# EAGLE design calculator (EAGLE 7.7.0)
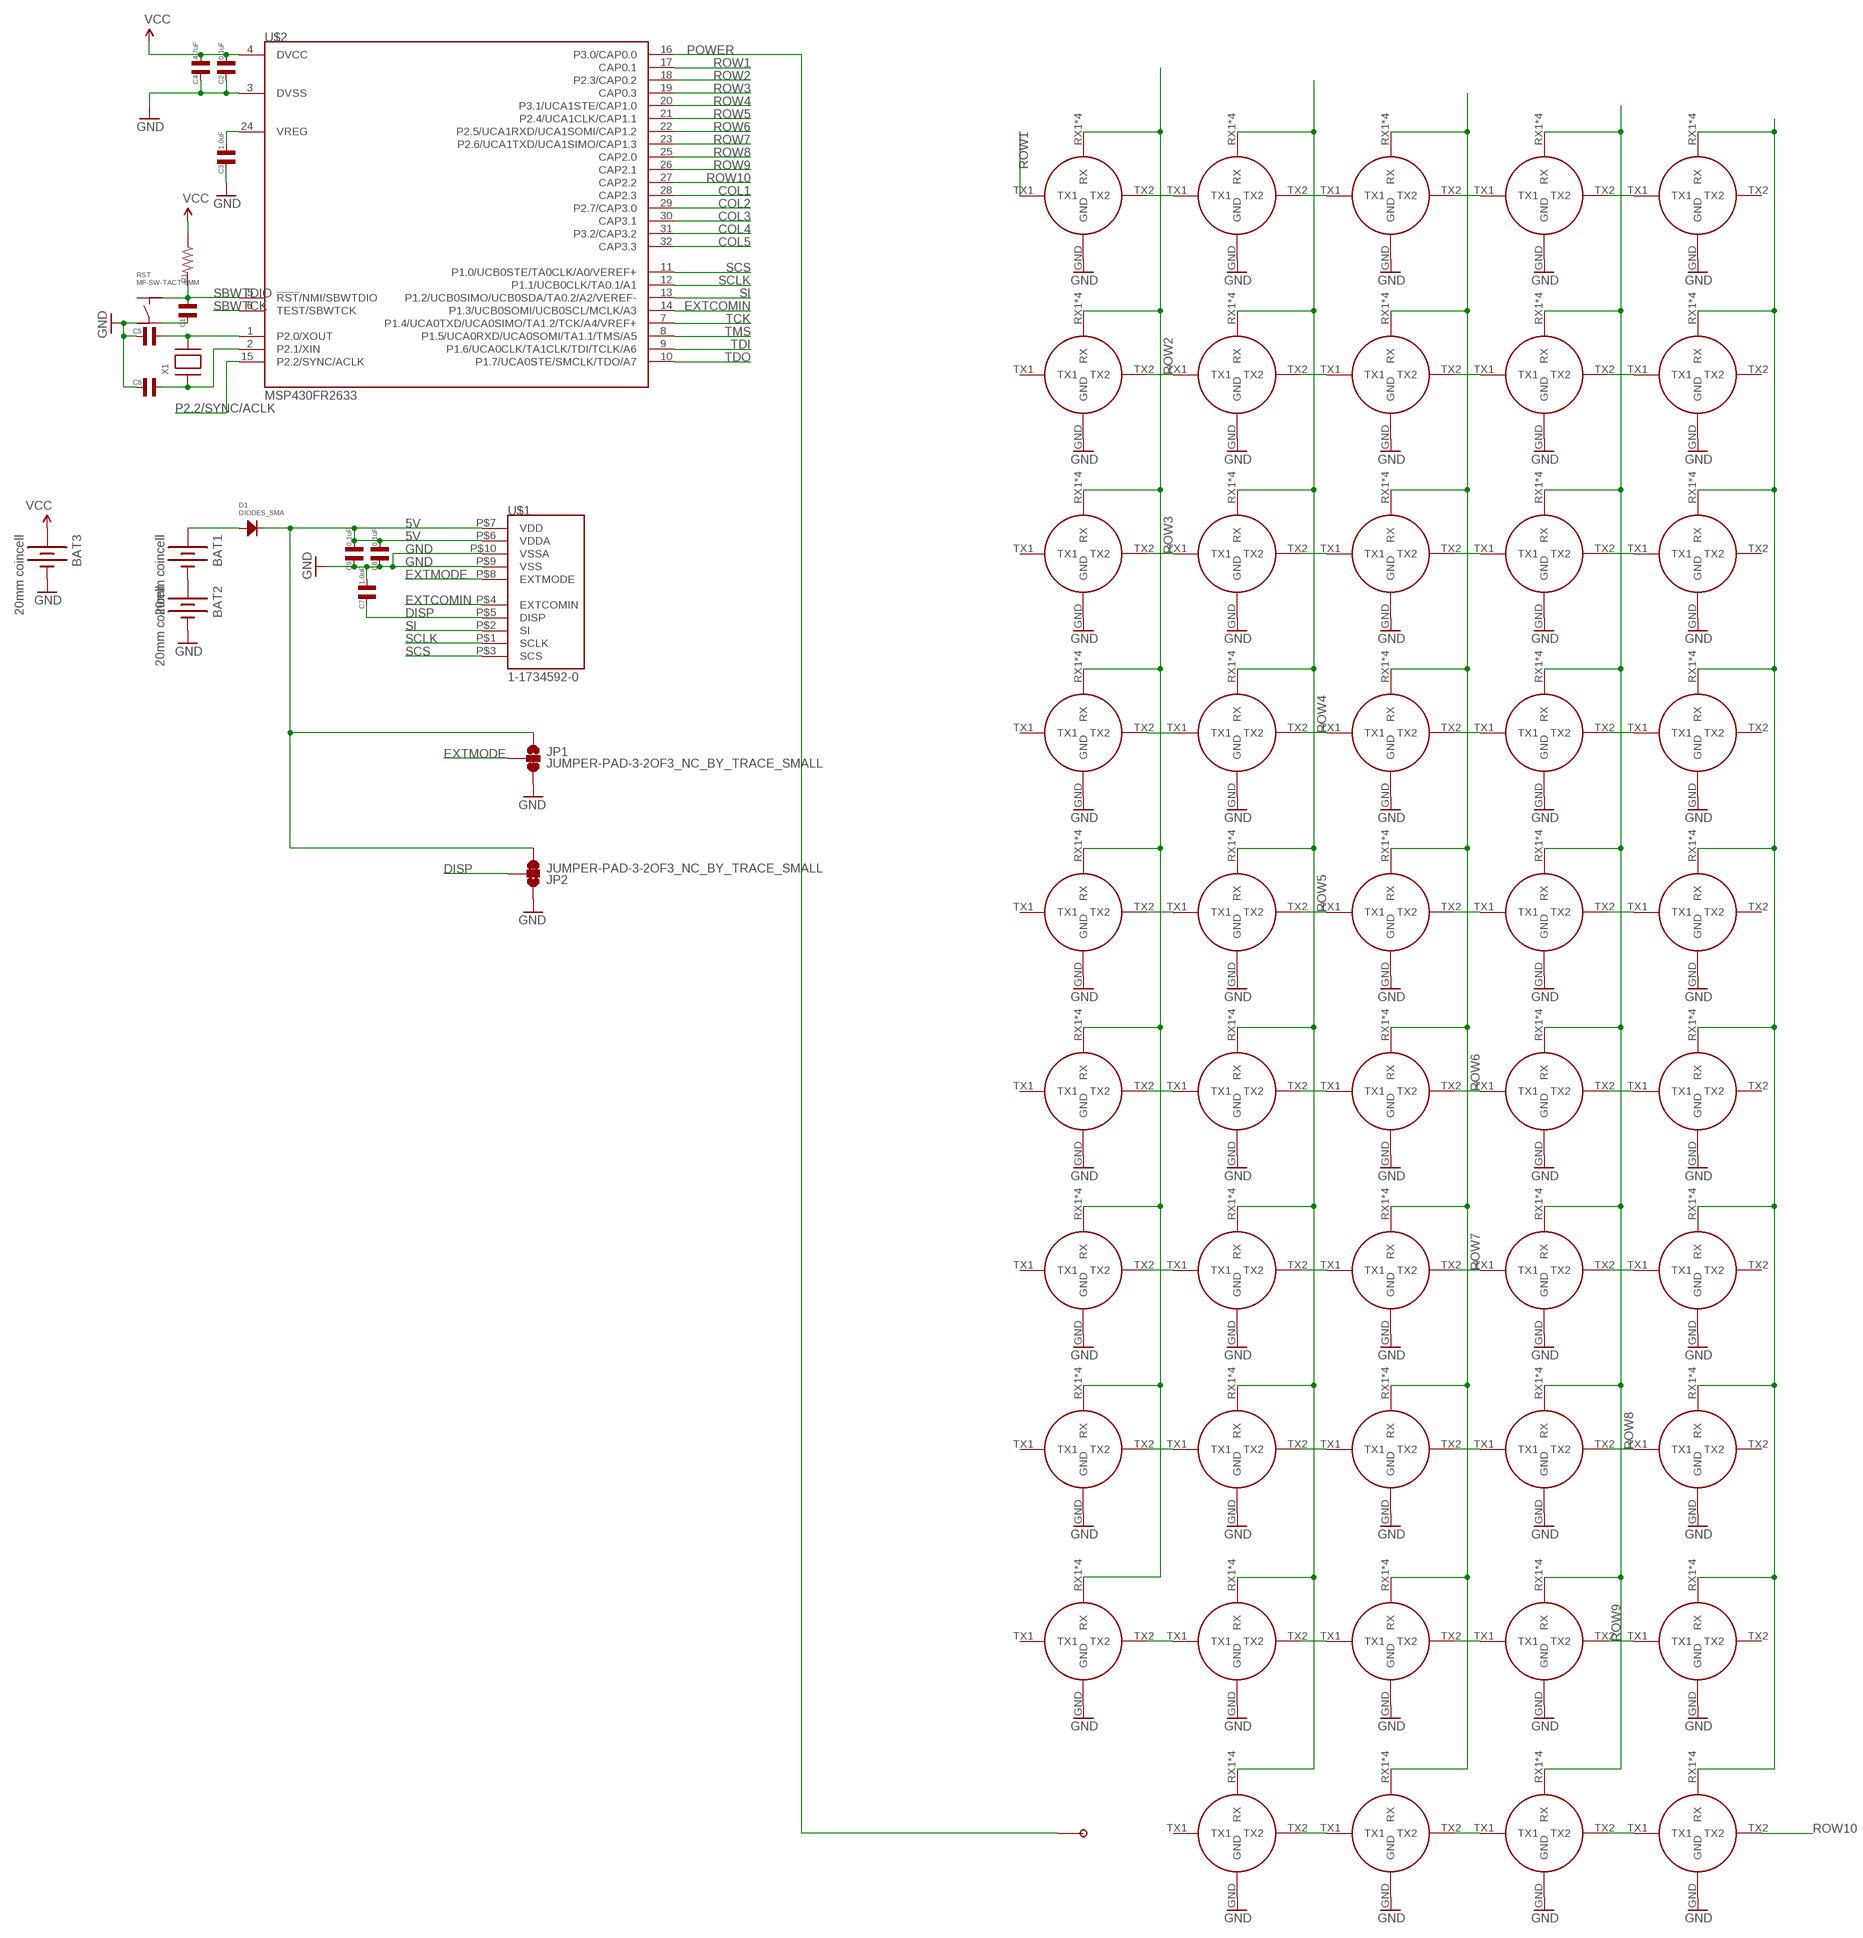
[diagram p0: schematic, sheet 1]

## Parts
BAT1  20mm coincell  BATTERY20MM_4LEGS  [BATTCON_20MM_4LEGS]
BAT2  20mm coincell  BATTERY20MM_4LEGS  [BATTCON_20MM_4LEGS]
BAT3  20mm coincell  BATTERY20MM_4LEGS  [BATTCON_20MM_4LEGS]
C1  CAPACITOR_NP_0603  [C0603]
C2  0.1uF  CAPACITOR_NP_0603  [C0603]
C3  1.0uF  CAPACITOR_NP_0603  [C0603]
C4  4.7uF  CAPACITOR_NP_0603  [C0603]
C5  CAPACITOR_NP_0402  [C0402]
C6  CAPACITOR_NP_0402  [C0402]
C7  1.0uF  CAPACITOR_NP_0603  [C0603]
C8  0.1uF  CAPACITOR_NP_0603  [C0603]
C9  0.1uF  CAPACITOR_NP_0603  [C0603]
D1  DIODES_SMA  [SMA]
JP1  JUMPER-PAD-3-2OF3_NC_BY_TRACE_SMALL  [PAD-JUMPER-3-2OF3_NC_BY_TRACE_YES_SILK_FULL_BOX]
JP2  JUMPER-PAD-3-2OF3_NC_BY_TRACE_SMALL  [PAD-JUMPER-3-2OF3_NC_BY_TRACE_YES_SILK_FULL_BOX]
P1  CAPPADPAD  [CAPTOUCHBTN2]
R1  RESISTOR_0603  [R0603]
RST  MF-SW-TACT-6MM  TACT_6MM  [TACT6MM]
U$1  1-1734592-0  [1-1734592-0]
U$2  MSP430FR2633  [TSSOP32]
U$3  CAPTOUCH  [CAPTOUCHBTN]
U$4  CAPTOUCH  [CAPTOUCHBTN]
U$5  CAPTOUCH  [CAPTOUCHBTN]
U$6  CAPTOUCH  [CAPTOUCHBTN]
U$7  CAPTOUCH  [CAPTOUCHBTN]
U$8  CAPTOUCH  [CAPTOUCHBTN]
U$9  CAPTOUCH  [CAPTOUCHBTN]
U$10  CAPTOUCH  [CAPTOUCHBTN]
U$11  CAPTOUCH  [CAPTOUCHBTN]
U$12  CAPTOUCH  [CAPTOUCHBTN]
U$13  CAPTOUCH  [CAPTOUCHBTN]
U$14  CAPTOUCH  [CAPTOUCHBTN]
U$15  CAPTOUCH  [CAPTOUCHBTN]
U$16  CAPTOUCH  [CAPTOUCHBTN]
U$17  CAPTOUCH  [CAPTOUCHBTN]
U$18  CAPTOUCH  [CAPTOUCHBTN]
U$19  CAPTOUCH  [CAPTOUCHBTN]
U$20  CAPTOUCH  [CAPTOUCHBTN]
U$21  CAPTOUCH  [CAPTOUCHBTN]
U$22  CAPTOUCH  [CAPTOUCHBTN]
U$23  CAPTOUCH  [CAPTOUCHBTN]
U$24  CAPTOUCH  [CAPTOUCHBTN]
U$25  CAPTOUCH  [CAPTOUCHBTN]
U$26  CAPTOUCH  [CAPTOUCHBTN]
U$27  CAPTOUCH  [CAPTOUCHBTN]
U$28  CAPTOUCH  [CAPTOUCHBTN]
U$29  CAPTOUCH  [CAPTOUCHBTN]
U$30  CAPTOUCH  [CAPTOUCHBTN]
U$31  CAPTOUCH  [CAPTOUCHBTN]
U$32  CAPTOUCH  [CAPTOUCHBTN]
U$33  CAPTOUCH  [CAPTOUCHBTN]
U$34  CAPTOUCH  [CAPTOUCHBTN]
U$35  CAPTOUCH  [CAPTOUCHBTN]
U$36  CAPTOUCH  [CAPTOUCHBTN]
U$37  CAPTOUCH  [CAPTOUCHBTN]
U$38  CAPTOUCH  [CAPTOUCHBTN]
U$39  CAPTOUCH  [CAPTOUCHBTN]
U$40  CAPTOUCH  [CAPTOUCHBTN]
U$41  CAPTOUCH  [CAPTOUCHBTN]
U$42  CAPTOUCH  [CAPTOUCHBTN]
U$43  CAPTOUCH  [CAPTOUCHBTN]
U$44  CAPTOUCH  [CAPTOUCHBTN]
U$45  CAPTOUCH  [CAPTOUCHBTN]
U$46  CAPTOUCH  [CAPTOUCHBTN]
U$47  CAPTOUCH  [CAPTOUCHBTN]
U$48  CAPTOUCH  [CAPTOUCHBTN]
U$49  CAPTOUCH  [CAPTOUCHBTN]
U$50  CAPTOUCH  [CAPTOUCHBTN]
U$51  CAPTOUCH  [CAPTOUCHBTN]
X1  XTAL-3.2X1.5  [XTAL3215]

## Nets
5V: C8.P$1 C9.P$1 D1.CATHODE JP1.1 JP2.3 U$1.P$6(VDDA) U$1.P$7(VDD)
COL1: U$2.28(CAP2.3) U$3.RX1(RX) U$3.RX2(RX) U$3.RX3(RX) U$3.RX4(RX) U$8.RX1(RX) U$8.RX2(RX) U$8.RX3(RX) U$8.RX4(RX) U$13.RX1(RX) U$13.RX2(RX) U$13.RX3(RX) U$13.RX4(RX) U$18.RX1(RX) U$18.RX2(RX) U$18.RX3(RX) U$18.RX4(RX) U$23.RX1(RX) U$23.RX2(RX) U$23.RX3(RX) U$23.RX4(RX) U$28.RX1(RX) U$28.RX2(RX) U$28.RX3(RX) U$28.RX4(RX) U$33.RX1(RX) U$33.RX2(RX) U$33.RX3(RX) U$33.RX4(RX) U$38.RX1(RX) U$38.RX2(RX) U$38.RX3(RX) U$38.RX4(RX) U$43.RX1(RX) U$43.RX2(RX) U$43.RX3(RX) U$43.RX4(RX)
COL2: U$2.29(P2.7/CAP3.0) U$4.RX1(RX) U$4.RX2(RX) U$4.RX3(RX) U$4.RX4(RX) U$9.RX1(RX) U$9.RX2(RX) U$9.RX3(RX) U$9.RX4(RX) U$14.RX1(RX) U$14.RX2(RX) U$14.RX3(RX) U$14.RX4(RX) U$19.RX1(RX) U$19.RX2(RX) U$19.RX3(RX) U$19.RX4(RX) U$24.RX1(RX) U$24.RX2(RX) U$24.RX3(RX) U$24.RX4(RX) U$29.RX1(RX) U$29.RX2(RX) U$29.RX3(RX) U$29.RX4(RX) U$34.RX1(RX) U$34.RX2(RX) U$34.RX3(RX) U$34.RX4(RX) U$39.RX1(RX) U$39.RX2(RX) U$39.RX3(RX) U$39.RX4(RX) U$44.RX1(RX) U$44.RX2(RX) U$44.RX3(RX) U$44.RX4(RX) U$48.RX1(RX) U$48.RX2(RX) U$48.RX3(RX) U$48.RX4(RX)
COL3: U$2.30(CAP3.1) U$5.RX1(RX) U$5.RX2(RX) U$5.RX3(RX) U$5.RX4(RX) U$10.RX1(RX) U$10.RX2(RX) U$10.RX3(RX) U$10.RX4(RX) U$15.RX1(RX) U$15.RX2(RX) U$15.RX3(RX) U$15.RX4(RX) U$20.RX1(RX) U$20.RX2(RX) U$20.RX3(RX) U$20.RX4(RX) U$25.RX1(RX) U$25.RX2(RX) U$25.RX3(RX) U$25.RX4(RX) U$30.RX1(RX) U$30.RX2(RX) U$30.RX3(RX) U$30.RX4(RX) U$35.RX1(RX) U$35.RX2(RX) U$35.RX3(RX) U$35.RX4(RX) U$40.RX1(RX) U$40.RX2(RX) U$40.RX3(RX) U$40.RX4(RX) U$45.RX1(RX) U$45.RX2(RX) U$45.RX3(RX) U$45.RX4(RX) U$49.RX1(RX) U$49.RX2(RX) U$49.RX3(RX) U$49.RX4(RX)
COL4: U$2.31(P3.2/CAP3.2) U$6.RX1(RX) U$6.RX2(RX) U$6.RX3(RX) U$6.RX4(RX) U$11.RX1(RX) U$11.RX2(RX) U$11.RX3(RX) U$11.RX4(RX) U$16.RX1(RX) U$16.RX2(RX) U$16.RX3(RX) U$16.RX4(RX) U$21.RX1(RX) U$21.RX2(RX) U$21.RX3(RX) U$21.RX4(RX) U$26.RX1(RX) U$26.RX2(RX) U$26.RX3(RX) U$26.RX4(RX) U$31.RX1(RX) U$31.RX2(RX) U$31.RX3(RX) U$31.RX4(RX) U$36.RX1(RX) U$36.RX2(RX) U$36.RX3(RX) U$36.RX4(RX) U$41.RX1(RX) U$41.RX2(RX) U$41.RX3(RX) U$41.RX4(RX) U$46.RX1(RX) U$46.RX2(RX) U$46.RX3(RX) U$46.RX4(RX) U$50.RX1(RX) U$50.RX2(RX) U$50.RX3(RX) U$50.RX4(RX)
COL5: U$2.32(CAP3.3) U$7.RX1(RX) U$7.RX2(RX) U$7.RX3(RX) U$7.RX4(RX) U$12.RX1(RX) U$12.RX2(RX) U$12.RX3(RX) U$12.RX4(RX) U$17.RX1(RX) U$17.RX2(RX) U$17.RX3(RX) U$17.RX4(RX) U$22.RX1(RX) U$22.RX2(RX) U$22.RX3(RX) U$22.RX4(RX) U$27.RX1(RX) U$27.RX2(RX) U$27.RX3(RX) U$27.RX4(RX) U$32.RX1(RX) U$32.RX2(RX) U$32.RX3(RX) U$32.RX4(RX) U$37.RX1(RX) U$37.RX2(RX) U$37.RX3(RX) U$37.RX4(RX) U$42.RX1(RX) U$42.RX2(RX) U$42.RX3(RX) U$42.RX4(RX) U$47.RX1(RX) U$47.RX2(RX) U$47.RX3(RX) U$47.RX4(RX) U$51.RX1(RX) U$51.RX2(RX) U$51.RX3(RX) U$51.RX4(RX)
DISP: C7.P$2 JP2.2 U$1.P$5(DISP)
EXTCOMIN: U$1.P$4(EXTCOMIN) U$2.14(P1.3/UCB0SOMI/UCB0SCL/MCLK/A3)
EXTMODE: JP1.2 U$1.P$8(EXTMODE)
GND: BAT2.NEGATIVE(-) BAT3.NEGATIVE(-) C2.P$2 C3.P$2 C4.P$2 C5.P$2 C6.P$2 C7.P$1 C8.P$2 C9.P$2 JP1.3 JP2.1 RST.P$3 U$1.P$9(VSS) U$1.P$10(VSSA) U$2.3(DVSS) U$3.GND U$4.GND U$5.GND U$6.GND U$7.GND U$8.GND U$9.GND U$10.GND U$11.GND U$12.GND U$13.GND U$14.GND U$15.GND U$16.GND U$17.GND U$18.GND U$19.GND U$20.GND U$21.GND U$22.GND U$23.GND U$24.GND U$25.GND U$26.GND U$27.GND U$28.GND U$29.GND U$30.GND U$31.GND U$32.GND U$33.GND U$34.GND U$35.GND U$36.GND U$37.GND U$38.GND U$39.GND U$40.GND U$41.GND U$42.GND U$43.GND U$44.GND U$45.GND U$46.GND U$47.GND U$48.GND U$49.GND U$50.GND U$51.GND
N$1: BAT1.NEGATIVE(-) BAT2.POSITIVE@1(+) BAT2.POSITIVE@2(+) BAT2.POSITIVE@3(+) BAT2.POSITIVE@4(+)
N$2: C3.P$1 U$2.24(VREG)
N$3: C1.P$2 RST.P$4
N$4: BAT1.POSITIVE@1(+) BAT1.POSITIVE@2(+) BAT1.POSITIVE@3(+) BAT1.POSITIVE@4(+) D1.ANODE
N$5: C5.P$1 U$2.1(P2.0/XOUT) X1.P$2
N$6: C6.P$1 U$2.2(P2.1/XIN) X1.P$1
N$7: U$3.TX2 U$4.TX1
N$8: U$4.TX2 U$5.TX1
N$9: U$5.TX2 U$6.TX1
N$10: U$6.TX2 U$7.TX1
N$11: U$18.TX2 U$19.TX1
N$12: U$9.TX2 U$10.TX1
N$13: U$10.TX2 U$11.TX1
N$14: U$11.TX2 U$12.TX1
N$16: U$14.TX2 U$15.TX1
N$17: U$15.TX2 U$16.TX1
N$18: U$16.TX2 U$17.TX1
N$21: U$20.TX2 U$21.TX1
N$22: U$21.TX2 U$22.TX1
N$23: U$23.TX2 U$24.TX1
N$25: U$25.TX2 U$26.TX1
N$26: U$26.TX2 U$27.TX1
N$27: U$28.TX2 U$29.TX1
N$28: U$29.TX2 U$30.TX1
N$30: U$31.TX2 U$32.TX1
N$31: U$33.TX2 U$34.TX1
N$32: U$34.TX2 U$35.TX1
N$34: U$36.TX2 U$37.TX1
N$35: U$38.TX2 U$39.TX1
N$36: U$39.TX2 U$40.TX1
N$37: U$40.TX2 U$41.TX1
N$39: U$43.TX2 U$44.TX1
N$40: U$44.TX2 U$45.TX1
N$41: U$45.TX2 U$46.TX1
N$43: U$48.TX2 U$49.TX1
N$44: U$49.TX2 U$50.TX1
N$45: U$50.TX2 U$51.TX1
P2.2/SYNC/ACLK: U$2.15(P2.2/SYNC/ACLK)
POWER: P1.RX U$2.16(P3.0/CAP0.0)
ROW1: U$2.17(CAP0.1) U$3.TX1
ROW2: U$2.18(P2.3/CAP0.2) U$8.TX2 U$9.TX1
ROW3: U$2.19(CAP0.3) U$13.TX2 U$14.TX1
ROW4: U$2.20(P3.1/UCA1STE/CAP1.0) U$19.TX2 U$20.TX1
ROW5: U$2.21(P2.4/UCA1CLK/CAP1.1) U$24.TX2 U$25.TX1
ROW6: U$2.22(P2.5/UCA1RXD/UCA1SOMI/CAP1.2) U$30.TX2 U$31.TX1
ROW7: U$2.23(P2.6/UCA1TXD/UCA1SIMO/CAP1.3) U$35.TX2 U$36.TX1
ROW8: U$2.25(CAP2.0) U$41.TX2 U$42.TX1
ROW9: U$2.26(CAP2.1) U$46.TX2 U$47.TX1
ROW10: U$2.27(CAP2.2) U$51.TX2
SBWTCK: U$2.6(TEST/SBWTCK)
SBWTDIO: C1.P$1 R1.P$2 RST.P$2 U$2.5(!RST!/NMI/SBWTDIO)
SCLK: U$1.P$1(SCLK) U$2.12(P1.1/UCB0CLK/TA0.1/A1)
SCS: U$1.P$3(SCS) U$2.11(P1.0/UCB0STE/TA0CLK/A0/VEREF+)
SI: U$1.P$2(SI) U$2.13(P1.2/UCB0SIMO/UCB0SDA/TA0.2/A2/VEREF-)
TCK: U$2.7(P1.4/UCA0TXD/UCA0SIMO/TA1.2/TCK/A4/VREF+)
TDI: U$2.9(P1.6/UCA0CLK/TA1CLK/TDI/TCLK/A6)
TDO: U$2.10(P1.7/UCA0STE/SMCLK/TDO/A7)
TMS: U$2.8(P1.5/UCA0RXD/UCA0SOMI/TA1.1/TMS/A5)
VCC: BAT3.POSITIVE@1(+) BAT3.POSITIVE@2(+) BAT3.POSITIVE@3(+) BAT3.POSITIVE@4(+) C2.P$1 C4.P$1 R1.P$1 U$2.4(DVCC)
Unconnected: RST.P$1 U$7.TX2 U$8.TX1 U$12.TX2 U$13.TX1 U$17.TX2 U$18.TX1 U$22.TX2 U$23.TX1 U$27.TX2 U$28.TX1 U$32.TX2 U$33.TX1 U$37.TX2 U$38.TX1 U$42.TX2 U$43.TX1 U$47.TX2 U$48.TX1

## Library data of the parts
BAT1-BAT3 = SparkFun-Electromechanical:BATTERY: Battery Holders Various common sizes : AA, AAA, 18650 (PRT-12895), 20mm coin cell and 12mm coin cell. 20MM_4LEGS, BATT-10373; PROD_ID: BATT-10373
C1-C9 = MF_Passives:CAPACITOR_NP: Library: MF_Passives Description: Device for Non-Polarized Capacitors. Manufacture part number (MPN) can be added via Attributes. Check https://factory.macrofab.com/parts for the house parts list.; POPULATE: 1
D1 = MF_Discrete_Semiconductor:DIODES: Library: MF_Discrete_Semiconductor Description: Device for Single Packaged Diodes.; HOUSEPART: NO; POPULATE: 1
JP1 JP2 = SparkFun-Passives:JUMPER-PAD-3-2OF3_NC_BY_TRACE
P1 = sonik:CAPPAD
R1 = MF_Passives:RESISTOR: Library: MF_Passives Description: Device for Resistors. Manufacture part number (MPN), Voltage, Tolerance, and Wattage Rating can be added via Attributes. Check https://factory.macrofab.com/parts for the house parts list.; POPULATE: 1
RST = MF_Switches:TACT: Library: MF_Switches Description: Device for Tact Switches. Manufacture part number (MFG#) can be added via Attributes.; HOUSEPART: YES; MPN: MF-SW-TACT-6MM; POPULATE: 1; URL: https://factory.macrofab.com/part/MF-SW-TACT-6MM
U$1 = sonik:1-1734592-0
U$2 = sonik:MSP430FR2633
U$3-U$51 = sonik:CAPTOUCH
X1 = adafruit:XTAL: Low cost SMT crystals, no capacitors included http://www.ladyada.net/library/eagle

## Board
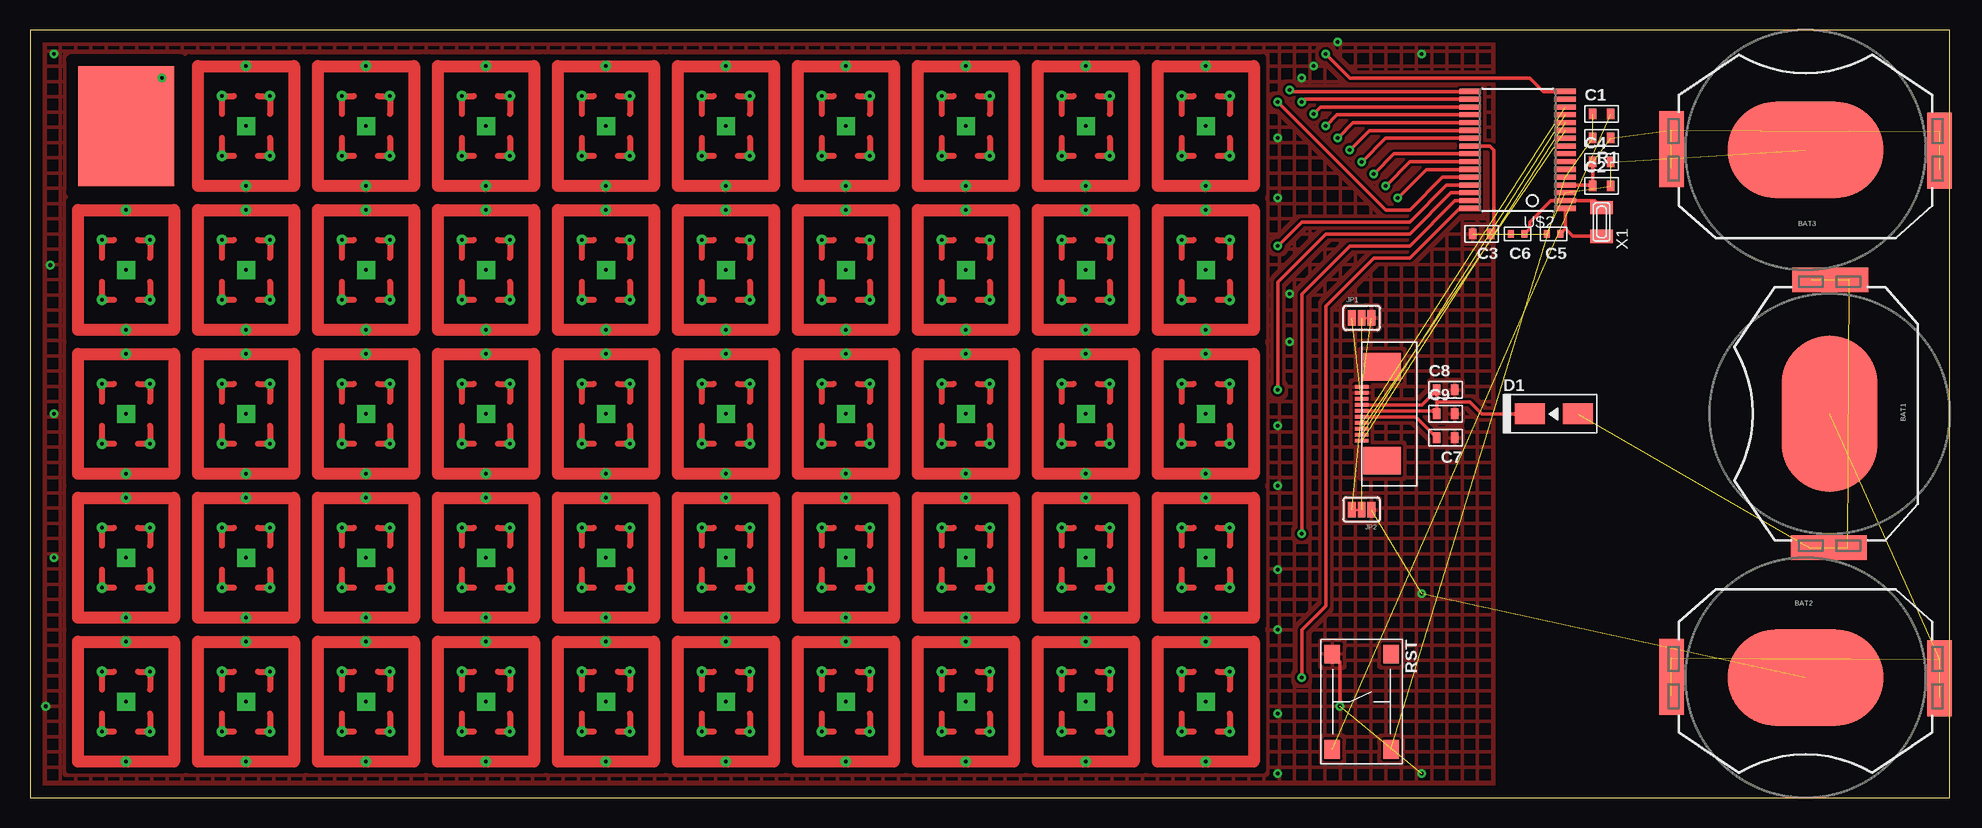
[diagram p1: board, top side]
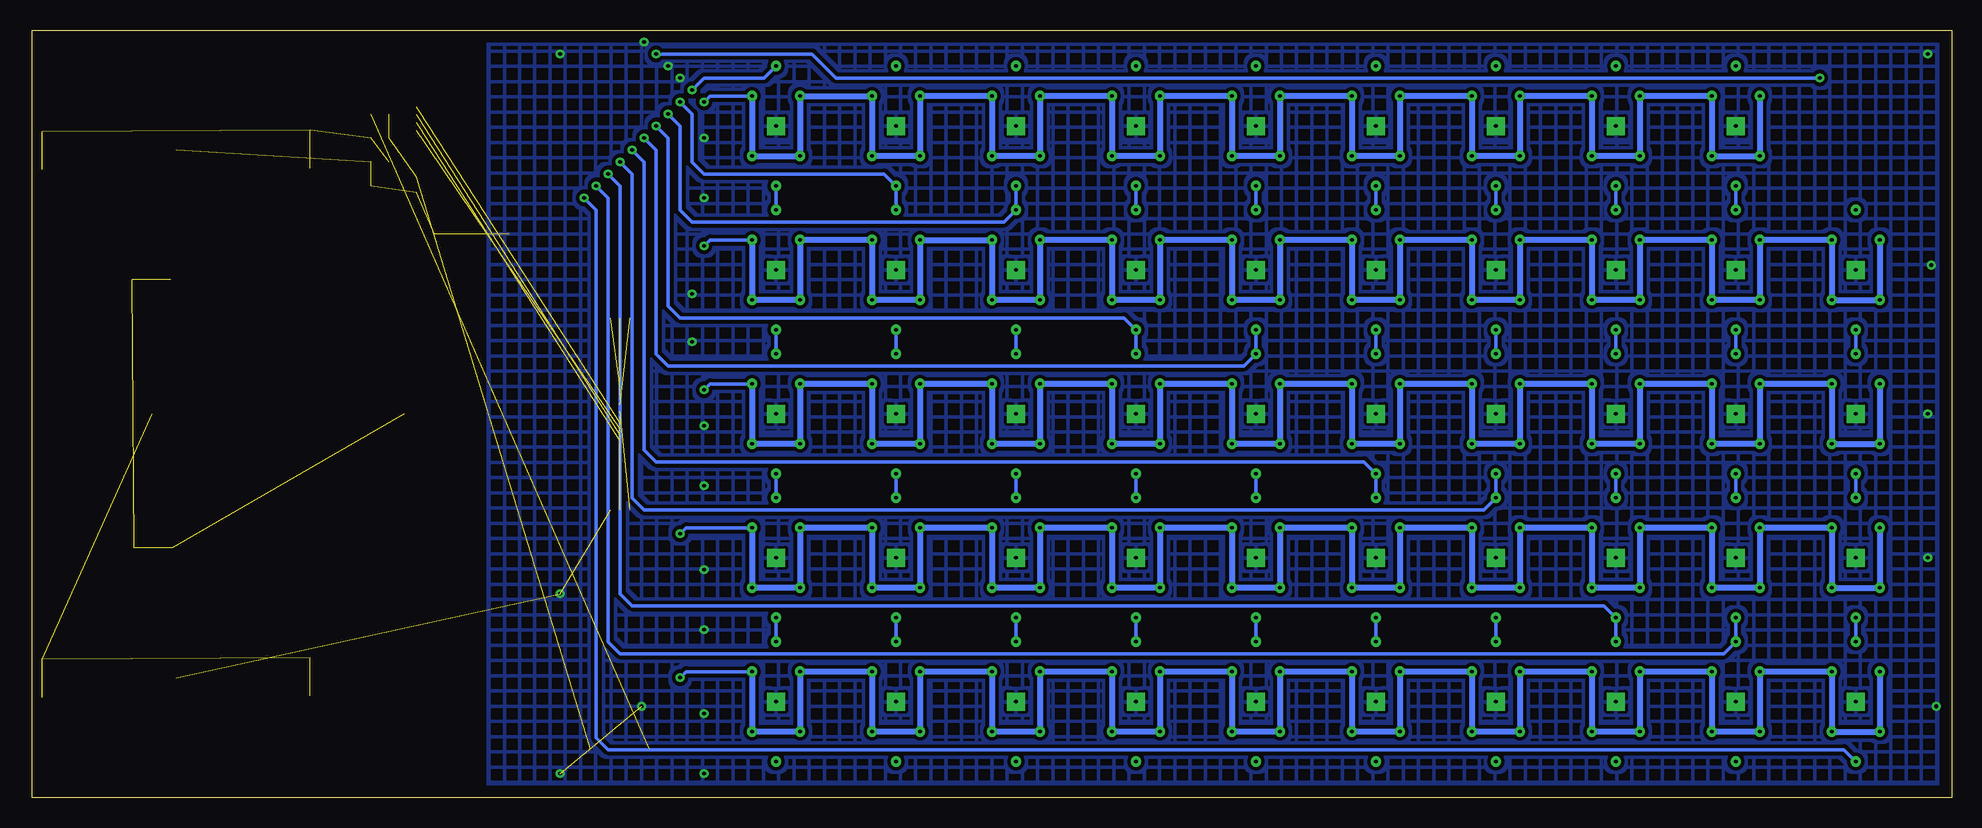
[diagram p2: board, bottom side, seen from below]

Size 160 x 64 mm. Coordinates in mm from the lower left corner, seen from the top.
Outline: 0,64 0,0 160,0 160,64 0,64
Copper layers (1*16): Top 0.035mm / dielectric 1.5mm / Bottom 0.035mm
Design rules "default": minimum track width 10mil, minimum drill 24mil, track to track 8mil, track to pad 8mil, pad to pad 8mil, via to via 8mil, smd to smd 8mil, copper to edge 40mil, drill to drill 8mil, minimum pad ring 10mil, minimum via ring 8mil, stop-mask expansion 4mil, vias tented up to drill 0mil, thermal gap 10mil

### Footprints (pad centres in the part's own frame; a part is rotated, then mirrored left to right if it is on the bottom)
BATTCON_20MM_4LEGS = smd 13 x 8: NEGATIVE 0,0 | smd 2.032 x 3.175: POSITIVE@1 -11.176,1.651; POSITIVE@2 -11.176,-1.524; POSITIVE@3 11.176,1.524; POSITIVE@4 11.176,-1.651
C0603 = smd 0.6 x 0.9: P$1 -0.75,0; P$2 0.75,0
C0402 = smd 0.5 x 0.6: P$1 -0.55,0; P$2 0.55,0
SMA = smd 2.5 x 1.7: ANODE 2,0; CATHODE -2,0
PAD-JUMPER-3-2OF3_NC_BY_TRACE_YES_SILK_FULL_BOX = smd 0.635 x 1.27: 1 -0.813,0; 2 0,0; 3 0.813,0
CAPTOUCHBTN2 = smd 10 x 8: RX 0,0
R0603 = smd 0.6 x 0.9: P$1 -0.75,0; P$2 0.75,0
TACT6MM = smd 1.55 x 1.3: P$1 -3.975,2.45; P$2 3.975,2.45; P$3 -3.975,-2.45; P$4 3.975,-2.45
1-1734592-0 = smd 0.3 x 1.1: P$1 -2.25,1; P$2 -1.75,1; P$3 -1.25,1; P$4 -0.75,1; P$5 -0.25,1; P$6 0.25,1; P$7 0.75,1; P$8 1.25,1; P$9 1.75,1; P$10 2.25,1 | smd 2.3 x 3.1: SLD1 -3.92,-0.7; SLD2 3.92,-0.7
TSSOP32 = smd 0.42 x 1.78: 1 -4.875,-3.97; 2 -4.225,-3.97; 3 -3.575,-3.97; 4 -2.925,-3.97; 5 -2.275,-3.97; 6 -1.625,-3.97; 7 -0.975,-3.97; 8 -0.325,-3.97; 9 0.325,-3.97; 10 0.975,-3.97; 11 1.625,-3.97; 12 2.275,-3.97; 13 2.925,-3.97; 14 3.575,-3.97; 15 4.225,-3.97; 16 4.875,-3.97; 17 4.875,3.97; 18 4.225,3.97; 19 3.575,3.97; 20 2.925,3.97; 21 2.275,3.97; 22 1.625,3.97; 23 0.975,3.97; 24 0.325,3.97; 25 -0.325,3.97; 26 -0.975,3.97; 27 -1.625,3.97; 28 -2.275,3.97; 29 -2.925,3.97; 30 -3.575,3.97; 31 -4.225,3.97; 32 -4.875,3.97
CAPTOUCHBTN = drill 0.33 pad 1.5 square: GND 0,0 | drill 0.33 pad 0.61: RX1 -2.5,2; RX2 2.5,2; RX3 2.5,-2; RX4 -2.5,-2; TX1 -5,0; TX2 5,0
XTAL3215 = smd 1.1 x 1.9: P$1 1.2,0; P$2 -1.2,0

### Placement (x,y rotation side)
BAT1  150,32 270 top
BAT2  148,10 0 top
BAT3  148,54 180 top
C1  131,57 0 top
C2  131,51 0 top
C3  121,47 180 top
C4  131,53 0 top
C5  127,47 180 top
C6  124,47 180 top
C7  118,30 180 top
C8  118,34 0 top
C9  118,32 0 top
D1  127,32 0 top
JP1  111,40 0 top
JP2  111,24 180 top
P1  8,56 270 top
R1  131,55 180 top
RST  111,8 270 top
U$1  112,32 90 top
U$2  124,54 90 top
U$3  98,56 270 top
U$4  98,44 270 top
U$5  98,32 270 top
U$6  98,20 270 top
U$7  98,8 270 top
U$8  88,56 270 top
U$9  88,44 270 top
U$10  88,32 270 top
U$11  88,20 270 top
U$12  88,8 270 top
U$13  78,56 270 top
U$14  78,44 270 top
U$15  78,32 270 top
U$16  78,20 270 top
U$17  78,8 270 top
U$18  68,56 270 top
U$19  68,44 270 top
U$20  68,32 270 top
U$21  68,20 270 top
U$22  68,8 270 top
U$23  58,56 270 top
U$24  58,44 270 top
U$25  58,32 270 top
U$26  58,20 270 top
U$27  58,8 270 top
U$28  48,56 270 top
U$29  48,44 270 top
U$30  48,32 270 top
U$31  48,20 270 top
U$32  48,8 270 top
U$33  38,56 270 top
U$34  38,44 270 top
U$35  38,32 270 top
U$36  38,20 270 top
U$37  38,8 270 top
U$38  28,56 270 top
U$39  28,44 270 top
U$40  28,32 270 top
U$41  28,20 270 top
U$42  28,8 270 top
U$43  18,56 270 top
U$44  18,44 270 top
U$45  18,32 270 top
U$46  18,20 270 top
U$47  18,8 270 top
U$48  8,44 270 top
U$49  8,32 270 top
U$50  8,20 270 top
U$51  8,8 270 top
X1  131,48 90 top

### Tracks (layer width: path | path; a pad name or v marks a point on that pad's centre or on a via)
5V  (2 unrouted)
  Top 0.305: U$1.P$7 116,32.75 C8.P$1 117.25,33 | D1.CATHODE 121,32 120,33 117.25,33 | U$1.P$6 117,32.25 C9.P$1 117.25,33
COL1  (via drill 0.33)
  Top 0.305: U$2.28 117.72,51.73 115,49 113,49 v104,58
  Bottom 0.305: v104,58 103.5,58.5 U$3.RX1
  Bottom 0.5: U$3.RX1 U$3.RX2 U$3.RX3 U$3.RX4 U$8.RX1 U$8.RX2 U$8.RX3 U$8.RX4 U$13.RX1 U$13.RX2 U$13.RX3 U$13.RX4 U$18.RX1 U$18.RX2 U$18.RX3 U$18.RX4 U$23.RX1 U$23.RX2 U$23.RX3 U$23.RX4 U$28.RX1 U$28.RX2 U$28.RX3 U$28.RX4 U$33.RX1 U$33.RX2 U$33.RX3 U$33.RX4 U$38.RX1 U$38.RX2 U$38.RX3 U$38.RX4 U$43.RX1 U$43.RX2 U$43.RX3 U$43.RX4
COL2  (via drill 0.33)
  Top 0.305: U$2.29 118.08,51.08 115,48 106,48 v104,46
  Bottom 0.305: v104,46 103.5,46.5 U$4.RX1
  Bottom 0.5: U$4.RX1 U$4.RX2 U$4.RX3 U$4.RX4 U$9.RX1 U$9.RX2 U$9.RX3 U$9.RX4 U$14.RX1 U$14.RX2 U$14.RX3 U$14.RX4 U$19.RX1 U$19.RX2 U$19.RX3 U$19.RX4 U$24.RX1 U$24.RX2 U$24.RX3 U$24.RX4 U$29.RX1 U$29.RX2 U$29.RX3 U$29.RX4 U$34.RX1 U$34.RX2 U$34.RX3 U$34.RX4 U$39.RX1 U$39.RX2 U$39.RX3 U$39.RX4 U$44.RX1 U$44.RX2 U$44.RX3 U$44.RX4 U$48.RX1 U$48.RX2 U$48.RX3 U$48.RX4
COL3  (via drill 0.33)
  Top 0.305: U$2.30 118.42,50.42 115,47 108,47 104,43 v104,34
  Bottom 0.305: v104,34 103.5,34.5 U$5.RX1
  Bottom 0.5: U$49.RX4 U$49.RX3 U$49.RX2 U$49.RX1 U$45.RX4 U$45.RX3 U$45.RX2 U$45.RX1 U$40.RX4 U$40.RX3 U$40.RX2 U$40.RX1 U$35.RX4 U$35.RX3 U$35.RX2 U$35.RX1 U$30.RX4 U$30.RX3 U$30.RX2 U$30.RX1 U$25.RX4 U$25.RX3 U$25.RX2 U$25.RX1 U$20.RX4 U$20.RX3 U$20.RX2 U$20.RX1 U$15.RX4 U$15.RX3 U$15.RX2 U$15.RX1 U$10.RX4 U$10.RX3 U$10.RX2 U$10.RX1 U$5.RX4 U$5.RX3 U$5.RX2 U$5.RX1
COL4  (via drill 0.33)
  Top 0.305: U$2.31 118.78,49.77 115,46 110,46 106,42 v106,22
  Bottom 0.305: v106,22 105.5,22.5 U$6.RX1
  Bottom 0.5: U$50.RX4 U$50.RX3 U$50.RX2 U$50.RX1 U$46.RX4 U$46.RX3 U$46.RX2 U$46.RX1 U$41.RX4 U$41.RX3 U$41.RX2 U$41.RX1 U$36.RX4 U$36.RX3 U$36.RX2 U$36.RX1 U$31.RX4 U$31.RX3 U$31.RX2 U$31.RX1 U$26.RX4 U$26.RX3 U$26.RX2 U$26.RX1 U$21.RX4 U$21.RX3 U$21.RX2 U$21.RX1 U$16.RX4 U$16.RX3 U$16.RX2 U$16.RX1 U$11.RX4 U$11.RX3 U$11.RX2 U$11.RX1 U$6.RX4 U$6.RX3 U$6.RX2 U$6.RX1
COL5  (via drill 0.33)
  Top 0.305: U$2.32 119.12,49.12 115,45 112,45 108,41 108,16 106,14 v106,10
  Bottom 0.305: v106,10 105.5,10.5 U$7.RX1
  Bottom 0.5: U$51.RX4 U$51.RX3 U$51.RX2 U$51.RX1 U$47.RX4 U$47.RX3 U$47.RX2 U$47.RX1 U$42.RX4 U$42.RX3 U$42.RX2 U$42.RX1 U$37.RX4 U$37.RX3 U$37.RX2 U$37.RX1 U$32.RX4 U$32.RX3 U$32.RX2 U$32.RX1 U$27.RX4 U$27.RX3 U$27.RX2 U$27.RX1 U$22.RX4 U$22.RX3 U$22.RX2 U$22.RX1 U$17.RX4 U$17.RX3 U$17.RX2 U$17.RX1 U$12.RX4 U$12.RX3 U$12.RX2 U$12.RX1 U$7.RX4 U$7.RX3 U$7.RX2 U$7.RX1
DISP  (1 unrouted)
  Top 0.305: U$1.P$5 115.5,31.75 C7.P$2
EXTCOMIN  (1 unrouted)
EXTMODE  (1 unrouted)
GND  (via drill 0.33)  (11 unrouted)
  Top 0.305: RST.P$3 109.2,11.32 v109.2,7.6
  other vias: 106,60 107,61 109,63 104,55 104,50 105,42 105,38 104,31 104,26 104,19 104,14 104,7 104,2 116,2 116,17 116,62 2,62 1.7,44.4 2,32 2,20 1.3,7.6
  pour Bottom (isolate 0.305, hatched): 122,0 0,0 0,64 122,64
  pour Top (hatched): 0,0 122,0 122,64 0,64
N$1  (4 unrouted)
N$2
  Top 0.305: U$2.24 121.67,54.33 122,54 122,47.25 C3.P$1
N$3  (1 unrouted)
N$4  (4 unrouted)
N$5
  Top 0.305: U$2.1 127.97,47.42 | 127.97,47.42 C5.P$1 | X1.P$2 128.59,46.8 127.97,47.42
N$6
  Top 0.305: C6.P$1 125,47.45 125,48 126.78,49.77 U$2.2 130.43,49.77 X1.P$1
N$7
  Bottom 0.305: U$3.TX2 U$4.TX1
N$8
  Bottom 0.305: U$4.TX2 U$5.TX1
N$9
  Bottom 0.305: U$5.TX2 U$6.TX1
N$10
  Bottom 0.305: U$6.TX2 U$7.TX1
N$11
  Bottom 0.305: U$18.TX2 U$19.TX1
N$12
  Bottom 0.305: U$9.TX2 U$10.TX1
N$13
  Bottom 0.305: U$10.TX2 U$11.TX1
N$14
  Bottom 0.305: U$11.TX2 U$12.TX1
N$16
  Bottom 0.305: U$15.TX1 U$14.TX2
N$17
  Bottom 0.305: U$16.TX1 U$15.TX2
N$18
  Bottom 0.305: U$17.TX1 U$16.TX2
N$21
  Bottom 0.305: U$21.TX1 U$20.TX2
N$22
  Bottom 0.305: U$22.TX1 U$21.TX2
N$23
  Bottom 0.305: U$23.TX2 U$24.TX1
N$25
  Bottom 0.305: U$26.TX1 U$25.TX2
N$26
  Bottom 0.305: U$27.TX1 U$26.TX2
N$27
  Bottom 0.305: U$28.TX2 U$29.TX1
N$28
  Bottom 0.305: U$29.TX2 U$30.TX1
N$30
  Bottom 0.305: U$32.TX1 U$31.TX2
N$31
  Bottom 0.305: U$33.TX2 U$34.TX1
N$32
  Bottom 0.305: U$34.TX2 U$35.TX1
N$34
  Bottom 0.305: U$37.TX1 U$36.TX2
N$35
  Bottom 0.305: U$38.TX2 U$39.TX1
N$36
  Bottom 0.305: U$39.TX2 U$40.TX1
N$37
  Bottom 0.305: U$41.TX1 U$40.TX2
N$39
  Bottom 0.305: U$43.TX2 U$44.TX1
N$40
  Bottom 0.305: U$44.TX2 U$45.TX1
N$41
  Bottom 0.305: U$46.TX1 U$45.TX2
N$43
  Bottom 0.305: U$48.TX2 U$49.TX1
N$44
  Bottom 0.305: U$50.TX1 U$49.TX2
N$45
  Bottom 0.305: U$51.TX1 U$50.TX2
POWER  (via drill 0.33)
  Top 0.305: P1.RX 11,59 v11,60 | v108,62 110,60 125,60 126.12,58.88 U$2.16
  Bottom 0.305: v11,60 93,60 95,62 v108,62
ROW1  (via drill 0.33)
  Top 0.305: U$2.17 105.12,58.88 v105,59
  Bottom 0.305: U$3.TX1 99,60 104,60 v105,59
ROW2  (via drill 0.33)
  Top 0.305: U$2.18 106.22,58.23 v106,58
  Bottom 0.305: v106,58 105,57 105,53 104,52 89,52 U$8.TX2 U$9.TX1
ROW3  (via drill 0.33)
  Top 0.305: U$2.19 107.58,57.58 v107,57
  Bottom 0.305: U$13.TX2 U$14.TX1 79,48 105,48 106,49 106,56 v107,57
ROW4  (via drill 0.33)
  Top 0.305: U$2.20 108.92,56.92 v108,56
  Bottom 0.305: v108,56 107,55 107,41 106,40 69,40 U$19.TX2 U$20.TX1
ROW5  (via drill 0.33)
  Top 0.305: U$2.21 110.28,56.27 v109,55
  Bottom 0.305: v109,55 108,54 108,37 107,36 59,36 U$25.TX1 U$24.TX2
ROW6  (via drill 0.33)
  Top 0.305: U$2.22 111.62,55.62 v110,54
  Bottom 0.305: v110,54 109,53 109,29 108,28 49,28 U$30.TX2 U$31.TX1
ROW7  (via drill 0.33)
  Top 0.305: U$2.23 112.97,54.98 v111,53
  Bottom 0.305: v111,53 110,52 110,25 109,24 39,24 U$36.TX1 U$35.TX2
ROW8  (via drill 0.33)
  Top 0.305: U$2.25 113.67,53.67 v112,52
  Bottom 0.305: v112,52 111,51 111,17 110,16 29,16 U$41.TX2 U$42.TX1
ROW9  (via drill 0.33)
  Top 0.305: U$2.26 115.03,53.02 v113,51
  Bottom 0.305: v113,51 112,50 112,13 111,12 19,12 U$47.TX1 U$46.TX2
ROW10  (via drill 0.33)
  Top 0.305: U$2.27 116.38,52.38 v114,50
  Bottom 0.305: v114,50 113,49 113,5 112,4 9,4 U$51.TX2
SBWTDIO  (3 unrouted)
SCLK  (1 unrouted)
SCS  (1 unrouted)
SI  (1 unrouted)
VCC  (5 unrouted)
  Top 0.305: U$2.4 130.18,51.08 C2.P$1 C4.P$1